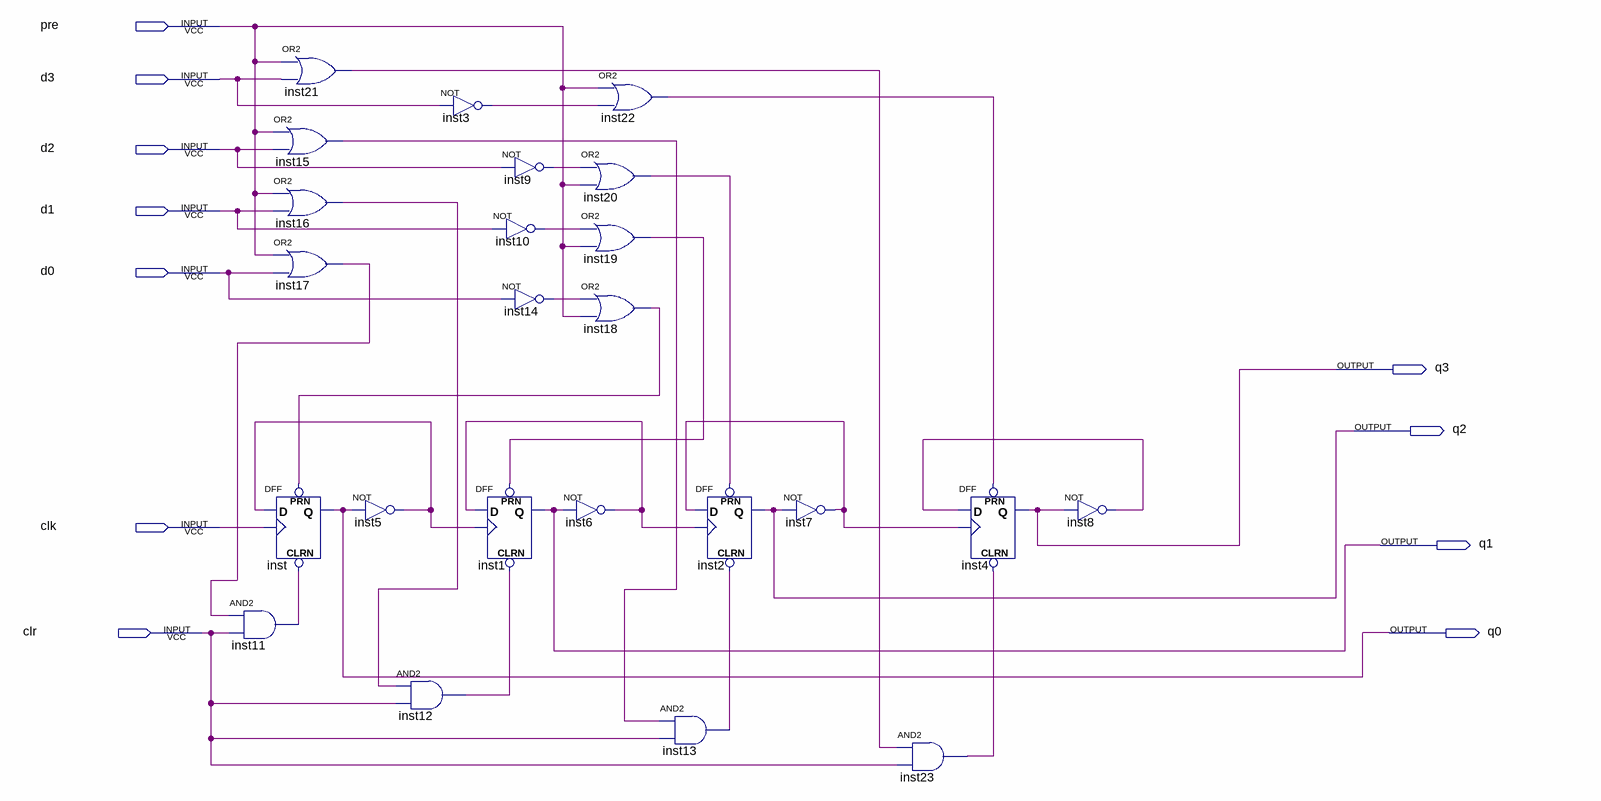
[diagram p0: schematic sheet]
// Quartus schematic counter.bdf as structural Verilog: 24 symbols, 11 pins
module counter (
  input  pre,
  input  d3,
  input  d2,
  input  d1,
  input  d0,
  input  clk,
  input  clr,
  output q3,
  output q2,
  output q1,
  output q0
);

  wire inst3_out, inst5_out, inst6_out, inst7_out, inst8_out, inst9_out, inst10_out, inst11_out, inst12_out,
       inst13_out, inst14_out, inst15_out, inst16_out, inst17_out, inst18_out, inst19_out, inst20_out,
       inst21_out, inst22_out, inst23_out;

  or inst21 (inst21_out, pre, d3);
  or inst15 (inst15_out, pre, d2);
  or inst16 (inst16_out, pre, d1);
  or inst17 (inst17_out, pre, d0);
  DFF inst (.CLRN(inst11_out), .CLK(clk), .D(inst5_out), .PRN(inst18_out), .Q(q0));
  and inst11 (inst11_out, inst17_out, clr);
  not inst5 (inst5_out, q0);
  and inst12 (inst12_out, inst16_out, clr);
  not inst3 (inst3_out, d3);
  not inst10 (inst10_out, d1);
  DFF inst1 (.CLRN(inst12_out), .CLK(inst5_out), .D(inst6_out), .PRN(inst19_out), .Q(q1));
  not inst9 (inst9_out, d2);
  not inst14 (inst14_out, d0);
  not inst6 (inst6_out, q1);
  or inst22 (inst22_out, pre, inst3_out);
  or inst20 (inst20_out, inst9_out, pre);
  or inst19 (inst19_out, inst10_out, pre);
  or inst18 (inst18_out, inst14_out, pre);
  DFF inst2 (.CLRN(inst13_out), .CLK(inst6_out), .D(inst7_out), .PRN(inst20_out), .Q(q2));
  and inst13 (inst13_out, inst15_out, clr);
  not inst7 (inst7_out, q2);
  and inst23 (inst23_out, inst21_out, clr);
  DFF inst4 (.CLRN(inst23_out), .CLK(inst7_out), .D(inst8_out), .PRN(inst22_out), .Q(q3));
  not inst8 (inst8_out, q3);
endmodule
